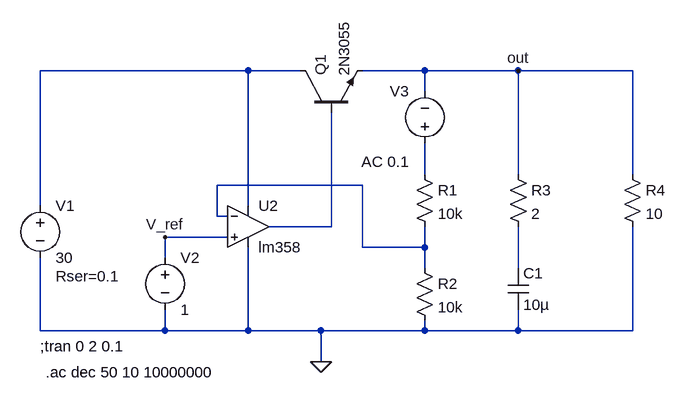
[diagram p0: schematic LM358_reg.asc]
LM358_reg.asc, the LTspice schematic file:
Version 4
SHEET 1 880 680
WIRE 224 48 -96 48
WIRE 304 48 224 48
WIRE 496 48 400 48
WIRE 640 48 496 48
WIRE 816 48 640 48
WIRE 496 80 496 48
WIRE 496 208 496 160
WIRE 640 208 640 48
WIRE 816 208 816 48
WIRE 400 224 176 224
WIRE -96 256 -96 48
WIRE 224 256 224 48
WIRE 176 272 176 224
WIRE 192 272 176 272
WIRE 352 288 352 112
WIRE 352 288 256 288
WIRE 192 304 96 304
WIRE 400 320 400 224
WIRE 496 320 496 288
WIRE 496 320 400 320
WIRE 96 336 96 304
WIRE 496 352 496 320
WIRE 640 352 640 288
WIRE -96 448 -96 336
WIRE 96 448 96 416
WIRE 96 448 -96 448
WIRE 224 448 224 320
WIRE 224 448 96 448
WIRE 336 448 224 448
WIRE 496 448 496 432
WIRE 496 448 336 448
WIRE 640 448 640 416
WIRE 640 448 496 448
WIRE 816 448 816 288
WIRE 816 448 640 448
WIRE 336 496 336 448
FLAG 640 48 out
FLAG 96 304 V_ref
FLAG 336 496 0
SYMBOL voltage -96 240 R0
WINDOW 123 0 0 Left 0
WINDOW 39 24 124 Left 2
SYMATTR SpiceLine Rser=0.1
SYMATTR InstName V1
SYMATTR Value 30
SYMBOL npn 304 112 R270
SYMATTR InstName Q1
SYMATTR Value 2N3055
SYMBOL res 480 192 R0
SYMATTR InstName R1
SYMATTR Value 10k
SYMBOL res 480 336 R0
SYMATTR InstName R2
SYMATTR Value 10k
SYMBOL voltage 96 320 R0
WINDOW 123 0 0 Left 0
WINDOW 39 0 0 Left 0
SYMATTR InstName V2
SYMATTR Value 1
SYMBOL cap 624 352 R0
SYMATTR InstName C1
SYMATTR Value 10µ
SYMBOL res 624 192 R0
SYMATTR InstName R3
SYMATTR Value 2
SYMBOL voltage 496 176 R180
WINDOW 0 24 96 Left 2
WINDOW 3 24 16 Left 2
WINDOW 123 24 -12 Left 2
WINDOW 39 0 0 Left 0
SYMATTR InstName V3
SYMATTR Value ""
SYMATTR Value2 AC 0.1
SYMBOL res 800 192 R0
SYMATTR InstName R4
SYMATTR Value 10
SYMBOL lm358 224 224 R0
SYMATTR InstName U2
TEXT -96 472 Left 2 !;tran 0 2 0.1
TEXT -88 512 Left 2 !.ac dec 50 10 10000000

The netlist it stands for:
* LM358_reg.asc
V1 N001 0 30 Rser=0.1
Q1 N001 N004 out 0 2N3055
R1 N002 N003 10k
R2 N003 0 10k
V2 V_ref 0 1
C1 N005 0 10µ
R3 out N005 2
V3 N002 out AC 0.1
R4 out 0 10
* U2: lm358 (symbol lm358 not available, pins judged from their places): In+=V_ref In-=N003 V+=N001 V-=0 OUT=N004
.model NPN NPN
.model PNP PNP
.lib standard.bjt
;tran 0 2 0.1
.ac dec 50 10 10000000
.backanno
.end